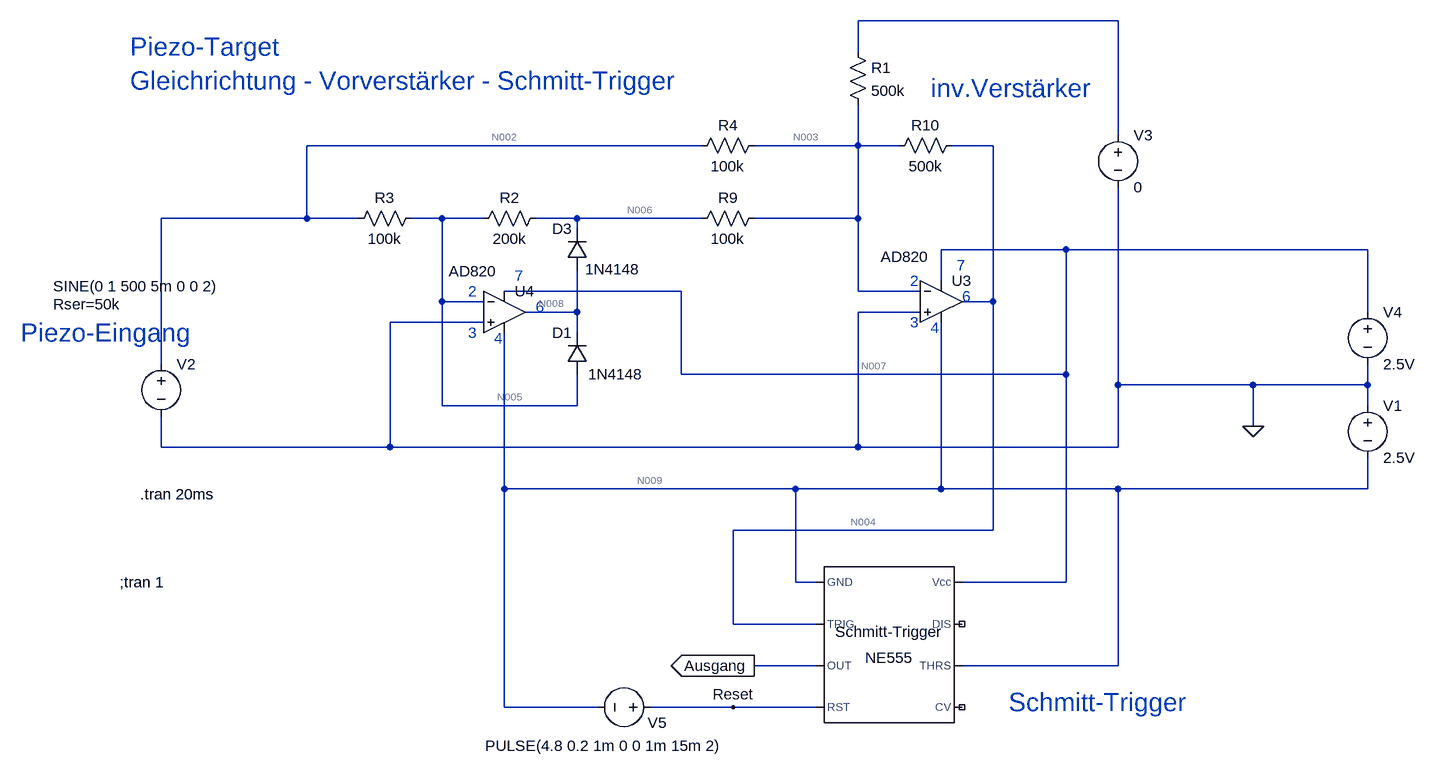
[diagram p0: schematic Abs_Verst_V8_cm.asc]
Abs_Verst_V8_cm.asc, the LTspice schematic file:
Version 4
SHEET 1 2224 768
WIRE 1760 -640 1360 -640
WIRE 1360 -592 1360 -640
WIRE 1760 -464 1760 -640
WIRE 1120 -448 512 -448
WIRE 1360 -448 1360 -512
WIRE 1360 -448 1200 -448
WIRE 1424 -448 1360 -448
WIRE 1568 -448 1504 -448
WIRE 512 -336 512 -448
WIRE 512 -336 288 -336
WIRE 592 -336 512 -336
WIRE 720 -336 672 -336
WIRE 784 -336 720 -336
WIRE 928 -336 864 -336
WIRE 1120 -336 928 -336
WIRE 1360 -336 1360 -448
WIRE 1360 -336 1200 -336
WIRE 928 -320 928 -336
WIRE 1680 -288 1488 -288
WIRE 2144 -288 1680 -288
WIRE 1488 -240 1488 -288
WIRE 1088 -224 816 -224
WIRE 1360 -224 1360 -336
WIRE 1456 -224 1360 -224
WIRE 720 -208 720 -336
WIRE 784 -208 720 -208
WIRE 1568 -208 1568 -448
WIRE 1568 -208 1520 -208
WIRE 928 -192 928 -256
WIRE 928 -192 848 -192
WIRE 1456 -192 1360 -192
WIRE 2144 -192 2144 -288
WIRE 784 -176 640 -176
WIRE 928 -160 928 -192
WIRE 288 -112 288 -336
WIRE 1088 -96 1088 -224
WIRE 1680 -96 1680 -288
WIRE 1680 -96 1088 -96
WIRE 1760 -80 1760 -384
WIRE 1968 -80 1760 -80
WIRE 2144 -80 2144 -112
WIRE 2144 -80 1968 -80
WIRE 720 -48 720 -208
WIRE 928 -48 928 -96
WIRE 928 -48 720 -48
WIRE 2144 -48 2144 -80
WIRE 1968 -16 1968 -80
WIRE 288 16 288 -32
WIRE 640 16 640 -176
WIRE 640 16 288 16
WIRE 1360 16 1360 -192
WIRE 1360 16 640 16
WIRE 1760 16 1760 -80
WIRE 1760 16 1360 16
WIRE 816 80 816 -160
WIRE 1264 80 816 80
WIRE 1488 80 1488 -176
WIRE 1488 80 1264 80
WIRE 1760 80 1488 80
WIRE 2144 80 2144 32
WIRE 2144 80 1760 80
WIRE 1568 144 1568 -208
WIRE 1568 144 1168 144
WIRE 1264 224 1264 80
WIRE 1296 224 1264 224
WIRE 1680 224 1680 -96
WIRE 1680 224 1520 224
WIRE 1168 288 1168 144
WIRE 1296 288 1168 288
WIRE 1296 352 1200 352
WIRE 1760 352 1760 80
WIRE 1760 352 1520 352
WIRE 816 416 816 80
WIRE 960 416 816 416
WIRE 1168 416 1040 416
WIRE 1296 416 1168 416
FLAG 1968 -16 0
FLAG 1200 352 Ausgang
IOPIN 1200 352 Out
FLAG 1168 416 Reset
SYMBOL res 688 -352 R90
WINDOW 0 0 56 VBottom 2
WINDOW 3 32 56 VTop 2
SYMATTR InstName R3
SYMATTR Value 100k
SYMBOL voltage 2144 -64 R0
WINDOW 123 0 0 Left 2
WINDOW 39 24 124 Left 2
SYMATTR InstName V1
SYMATTR Value 2.5V
SYMBOL voltage 288 -128 R0
WINDOW 123 0 0 Left 2
WINDOW 39 -166 -76 Left 2
WINDOW 3 -166 -104 Left 2
SYMATTR SpiceLine Rser=50k
SYMATTR Value SINE(0 1 500 5m 0 0 2)
SYMATTR InstName V2
SYMBOL Misc\\NE555 1408 320 R0
SYMATTR InstName Schmitt-Trigger
SYMBOL res 1216 -352 R90
WINDOW 0 0 56 VBottom 2
WINDOW 3 32 56 VTop 2
SYMATTR InstName R9
SYMATTR Value 100k
SYMBOL res 1520 -464 R90
WINDOW 0 0 56 VBottom 2
WINDOW 3 32 56 VTop 2
SYMATTR InstName R10
SYMATTR Value 500k
SYMBOL diode 944 -256 R180
WINDOW 0 24 64 Left 2
WINDOW 3 -81 2 Left 2
SYMATTR InstName D3
SYMATTR Value 1N4148
SYMBOL Opamps\\AD820 1488 -272 R0
WINDOW 3 -93 -5 Left 2
SYMATTR InstName U3
SYMBOL Opamps\\AD820 816 -256 R0
WINDOW 3 -86 1 Left 2
SYMATTR InstName U4
SYMBOL diode 944 -96 R180
WINDOW 0 24 64 Left 2
WINDOW 3 -86 0 Left 2
SYMATTR InstName D1
SYMATTR Value 1N4148
SYMBOL res 880 -352 R90
WINDOW 0 0 56 VBottom 2
WINDOW 3 32 56 VTop 2
SYMATTR InstName R2
SYMATTR Value 200k
SYMBOL res 1216 -464 R90
WINDOW 0 0 56 VBottom 2
WINDOW 3 32 56 VTop 2
SYMATTR InstName R4
SYMATTR Value 100k
SYMBOL res 1344 -608 R0
SYMATTR InstName R1
SYMATTR Value 500k
SYMBOL voltage 1760 -480 R0
WINDOW 123 0 0 Left 2
WINDOW 39 24 124 Left 2
SYMATTR InstName V3
SYMATTR Value 0
SYMBOL voltage 2144 -208 R0
WINDOW 123 0 0 Left 2
WINDOW 39 24 124 Left 2
SYMATTR InstName V4
SYMATTR Value 2.5V
SYMBOL voltage 1056 416 R90
WINDOW 123 0 0 Left 2
WINDOW 39 0 0 Left 2
WINDOW 3 59 -95 VRight 2
WINDOW 0 24 -10 VRight 2
SYMATTR Value PULSE(4.8 0.2 1m 0 0 1m 15m 2)
SYMATTR InstName V5
TEXT 256 88 Left 2 !.tran 20ms
TEXT 864 -200 Left 2 ;6
TEXT 1520 -216 Left 2 ;6
TEXT 760 -224 Left 2 ;2
TEXT 1440 -240 Left 2 ;2
TEXT 760 -160 Left 2 ;3
TEXT 1440 -176 Left 2 ;3
TEXT 832 -248 Left 2 ;7
TEXT 1512 -264 Left 2 ;7
TEXT 1472 -168 Left 2 ;4
TEXT 800 -152 Left 2 ;4
TEXT 72 -160 Left 4 ;Piezo-Eingang
TEXT 1472 -536 Left 4 ;inv.Verstärker
TEXT 1592 408 Left 4 ;Schmitt-Trigger
TEXT 240 -600 Left 4 ;Piezo-Target\nGleichrichtung - Vorverstärker - Schmitt-Trigger
TEXT 224 224 Left 2 !;tran 1

The netlist it stands for:
* Abs_Verst_V8_cm.asc
R3 N005 N002 100k
V1 0 N009 2.5V
V2 N002 0 SINE(0 1 500 5m 0 0 2) Rser=50k
XSchmitt-Trigger N009 N004 Ausgang Reset NC_01 N009 NC_02 N007 NE555  ; pins GND TRIG OUT RST CV THRS DIS Vcc
R9 N003 N006 100k
R10 N004 N003 500k
D3 N008 N006 1N4148
XU3 0 N003 N007 N009 N004 AD820  ; pins In+ In- V+ V- OUT
XU4 0 N005 N007 N009 N008 AD820  ; pins In+ In- V+ V- OUT
D1 N005 N008 1N4148
R2 N006 N005 200k
R4 N003 N002 100k
R1 N001 N003 500k
V3 N001 0 0
V4 N007 0 2.5V
V5 Reset N009 PULSE(4.8 0.2 1m 0 0 1m 15m 2)
.model D D
.lib standard.dio
.tran 20ms
* 6
* 6
* 2
* 2
* 3
* 3
* 7
* 7
* 4
* 4
* Piezo-Eingang
* inv.Verstärker
* Schmitt-Trigger
* Piezo-Target
* Gleichrichtung - Vorverstärker - Schmitt-Trigger
;tran 1
.lib NE555.sub
.backanno
.end

* Results of the author's LTspice run, read from the files saved beside the schematic
* Operating Point, zero values left out:
*   V(n005) = 158.3 µV
*   V(n002) = 79.14 µV
*   V(n009) = -2.5 V
*   V(n004) = 475 µV
*   V(n007) = 2.5 V
*   V(ausgang) = 2.5 V
*   V(reset) = 2.3 V
*   V(n003) = 158.3 µV
*   V(n006) = 205 µV
*   V(n008) = 11.33 mV
*   I(D1) = -550.5 pA
*   I(D3) = 701.1 pA
*   I(R1) = -316.6 pA
*   I(R4) = 791.4 pA
*   I(R2) = 233.7 pA
*   I(R10) = 633.5 pA
*   I(R9) = -467.4 pA
*   I(R3) = 791.4 pA
*   I(V5) = 9.427 µA
*   I(V4) = -2.699 mA
*   I(V3) = 316.6 pA
*   I(V2) = 1.583 nA
*   I(V1) = -2.699 mA
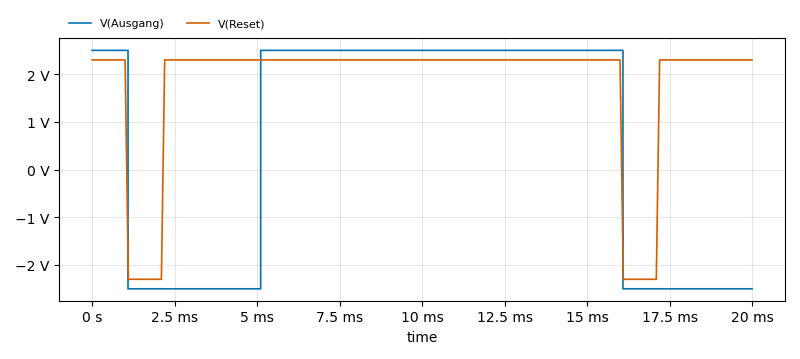
[diagram p1: Transient Analysis of Abs_Verst_V8_cm.asc, plotted from the saved traces]
* Transient Analysis, 1 run:
*   V(Ausgang): min -2.5 V, max 2.5 V, average 517.3 mV, rms 2.5 V, last -2.5 V
*   V(Reset): min -2.3 V, max 2.3 V, average 1.794 V, rms 2.285 V, last 2.3 V